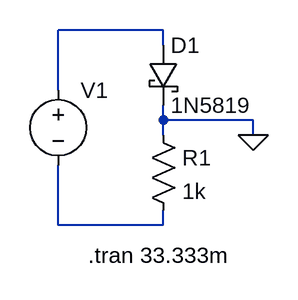
[diagram p0: schematic Diodo_1N5819_trans.asc]
Diodo_1N5819_trans.asc, the LTspice schematic file:
Version 4
SHEET 1 880 680
WIRE 192 128 80 128
WIRE 192 144 192 128
WIRE 80 192 80 128
WIRE 192 224 192 208
WIRE 288 224 192 224
WIRE 192 240 192 224
WIRE 288 240 288 224
WIRE 80 336 80 272
WIRE 192 336 192 320
WIRE 192 336 80 336
FLAG 288 240 0
SYMBOL schottky 176 144 R0
SYMATTR InstName D1
SYMATTR Value 1N5819
SYMATTR Description Diode
SYMATTR Type diode
SYMBOL res 176 224 R0
SYMATTR InstName R1
SYMATTR Value 1k
SYMBOL voltage 80 176 R0
WINDOW 3 24 96 Invisible 2
WINDOW 123 0 0 Left 0
SYMATTR Value SINE(0 0.5 30 0 0 0 0)
SYMATTR InstName V1
SYMATTR SpiceLine Rser=0
TEXT 112 368 Left 2 !.tran 33.333m

The netlist it stands for:
* Diodo_1N5819_trans.asc
D1 N001 0 1N5819
R1 0 N002 1k
V1 N001 N002 SINE(0 0.5 30 0 0 0 0) Rser=0
.model D D
.lib standard.dio
.tran 33.333m
.backanno
.end